# Altium schematic sheet I2C_MUX.SchDoc: RFSoC AMC
size 420 x 297 mm; CmpIndex: 31; CompanyName: WUT; DrawnBy: T. Przywozki; Organization: WUT ISE; Address1: Warsaw University of Technology; Address2: Nowowiejska 15/19 00-665 Warsaw; Address3: Tomasz.Przywozki@pw.edu.pl; DocumentNumber: 30; Revision: 1; SheetNumber: 30; SheetTotal: 45; Project: RFSoC AMC; ModifiedBy: T. Przywozki; CreateDate: -; CheckedDate: -; DivGrp: ISE; Designer: T. Przywozki; ModifiedDate: -; ProjectName: ADC/DAC MEZZANINE
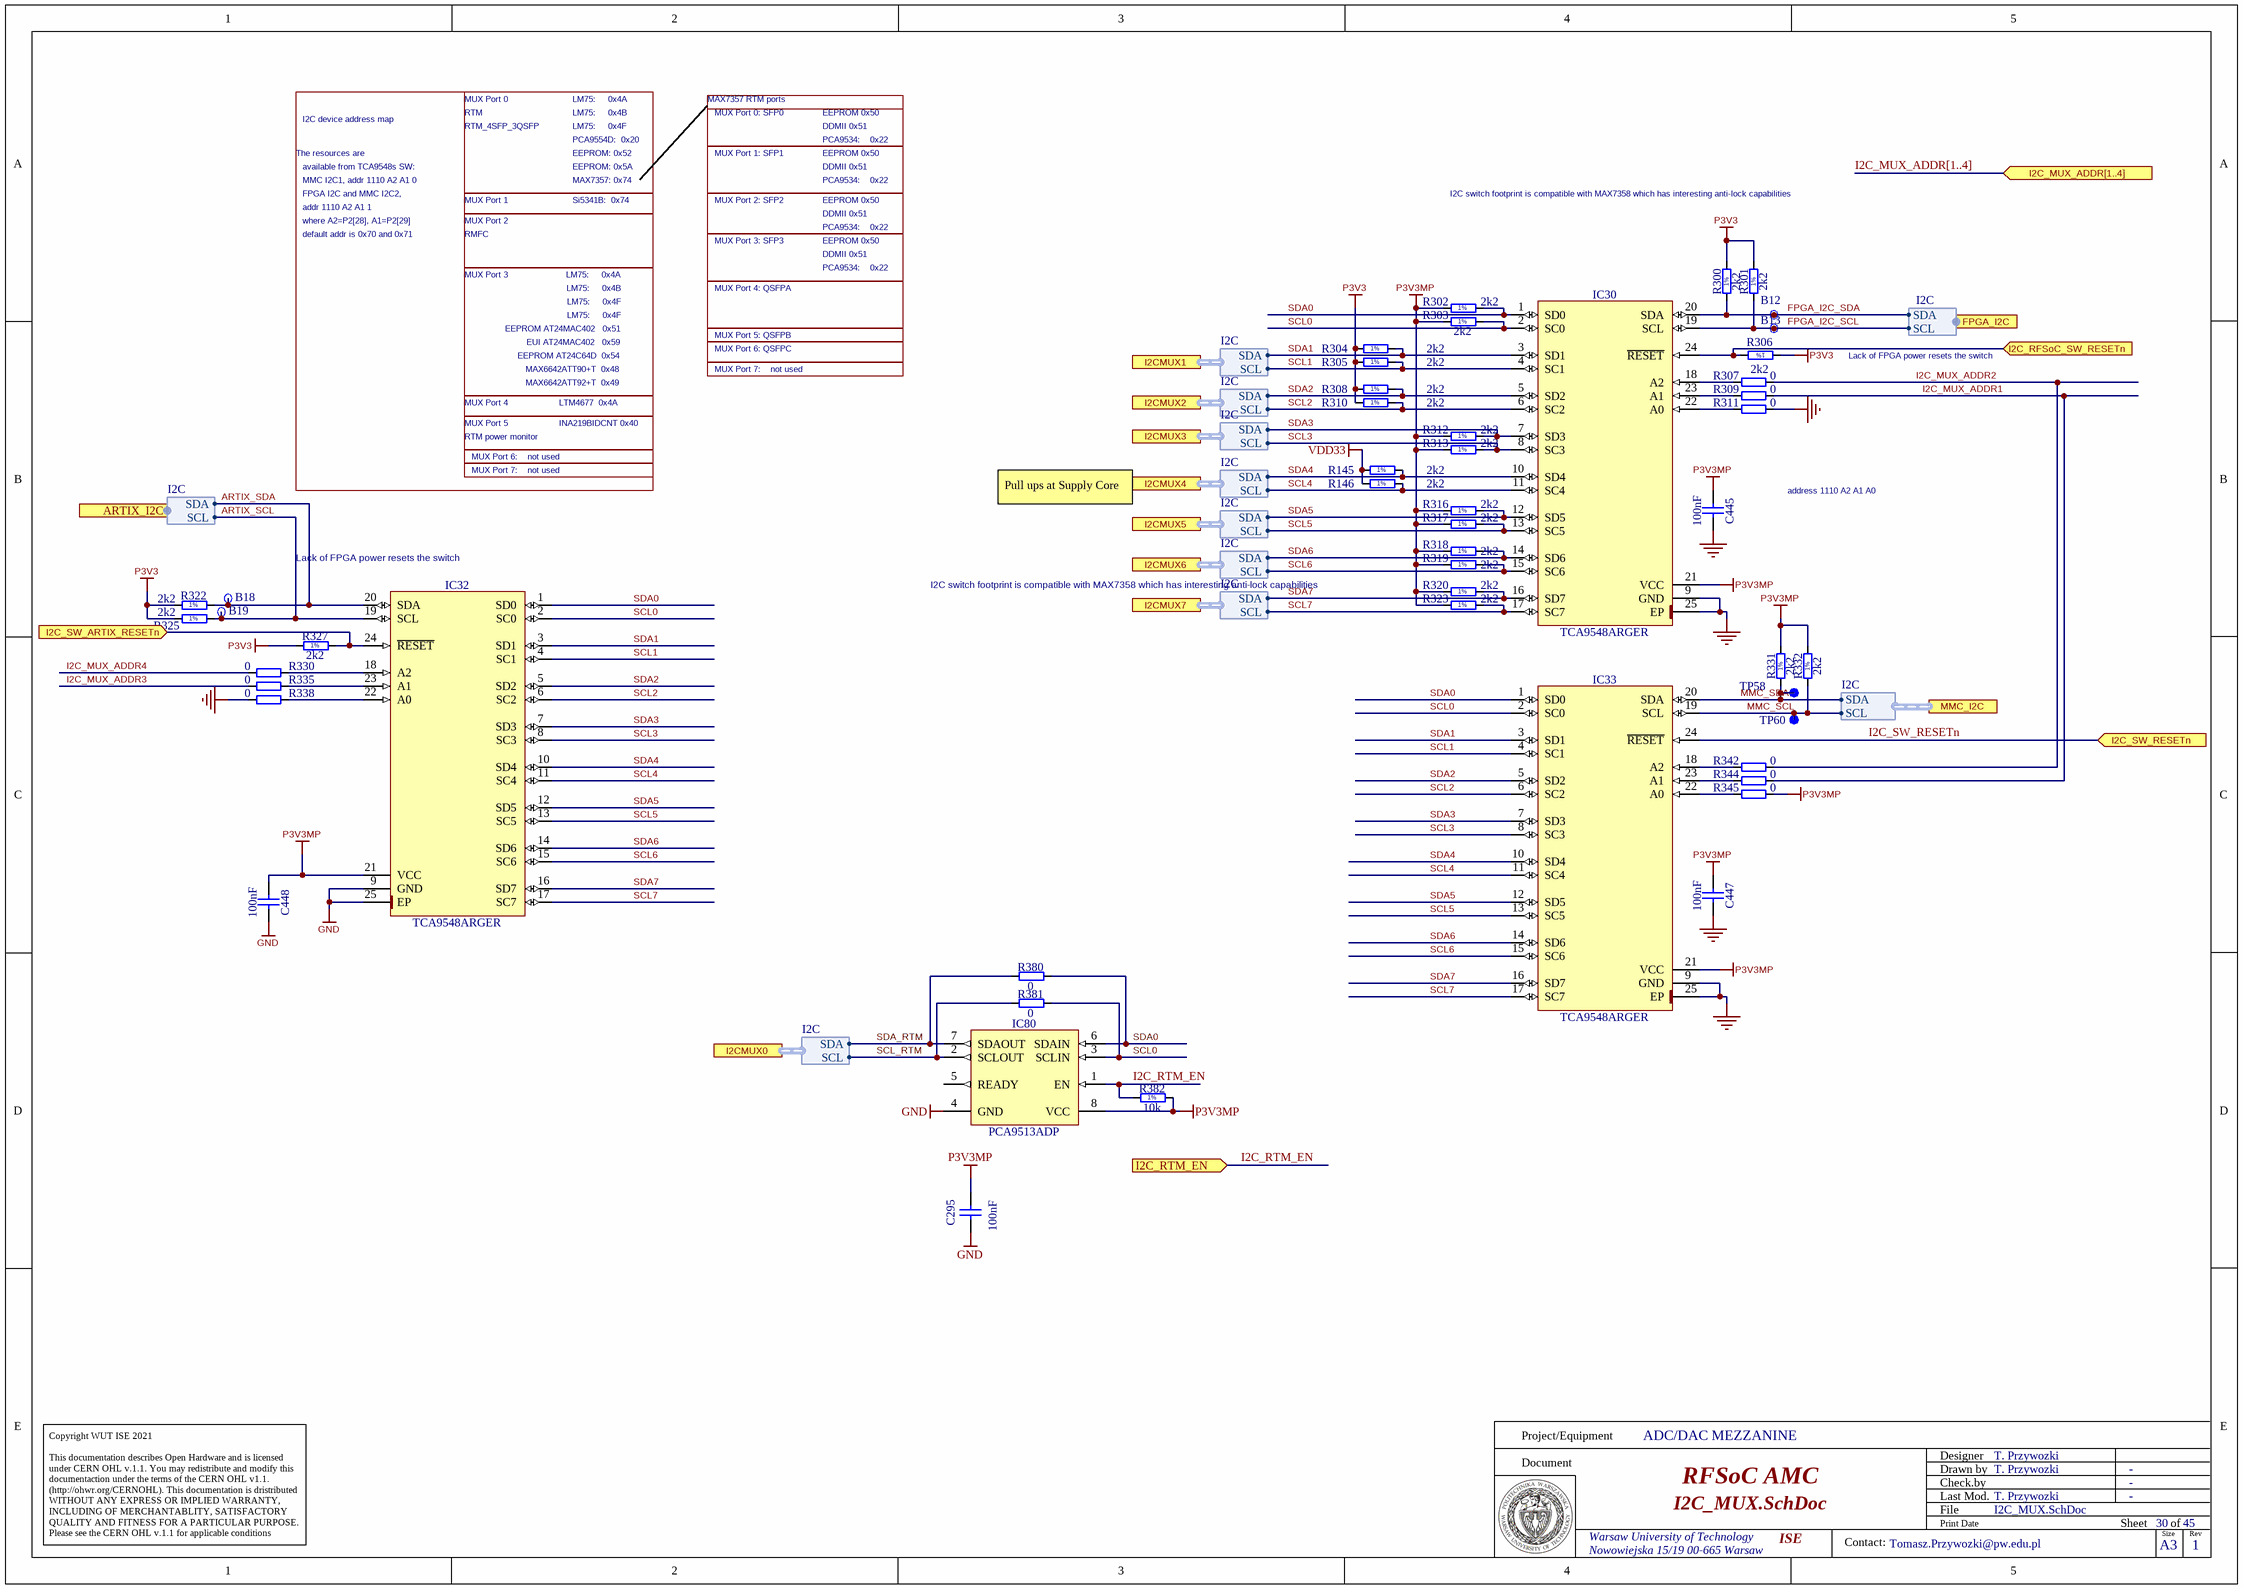
[diagram p0: I2C_MUX.SchDoc]

## Parts
B12  SMD_PAD_D1MM  [C100]  (value not drawn)
B13  SMD_PAD_D1MM  [C100]  (value not drawn)
B18  SMD_PAD_D1MM  [C100]  (value not drawn)
B19  SMD_PAD_D1MM  [C100]  (value not drawn)
C295  100nF  [CAPC0603X33N]
C445  100nF  [CAPC0603X33N]
C447  100nF  [CAPC0603X33N]
C448  100nF  [CAPC0603X33N]
IC30  TCA9548ARGER  [QFN50P400X400X100-25N-S220]
IC32  TCA9548ARGER  [QFN50P400X400X100-25N-S220]
IC33  TCA9548ARGER  [QFN50P400X400X100-25N-S220]
IC80  PCA9513ADP  [SOP65P490X110-8N]
R145  2k2  [RESC1005X40N]
R146  2k2  [RESC1005X40N]
R300  2k2  [RESC1005X40N]
R301  2k2  [RESC1005X40N]
R302  2k2  [RESC1005X40N]
R303  2k2  [RESC1005X40N]
R304  2k2  [RESC1005X40N]
R305  2k2  [RESC1005X40N]
R306  2k2  [RESC1005X40N]
R307  0  [RESC1005X40N]
R308  2k2  [RESC1005X40N]
R309  0  [RESC1005X40N]
R310  2k2  [RESC1005X40N]
R311  0  [RESC1005X40N]
R312  2k2  [RESC1005X40N]
R313  2k2  [RESC1005X40N]
R316  2k2  [RESC1005X40N]
R317  2k2  [RESC1005X40N]
R318  2k2  [RESC1005X40N]
R319  2k2  [RESC1005X40N]
R320  2k2  [RESC1005X40N]
R322  2k2  [RESC1005X40N]
R323  2k2  [RESC1005X40N]
R325  2k2  [RESC1005X40N]
R327  2k2  [RESC1005X40N]
R330  0  [RESC1005X40N]
R331  2k2  [RESC1005X40N]
R332  2k2  [RESC1005X40N]
R335  0  [RESC1005X40N]
R338  0  [RESC1005X40N]
R342  0  [RESC1005X40N]
R344  0  [RESC1005X40N]
R345  0  [RESC1005X40N]
R380  0  [RESC1005X40N]
R381  0  [RESC1005X40N]
R382  10k  [RESC1005X40N]
TP58  SMD Pad  [C100]  (value not drawn)
TP60  SMD Pad  [C100]  (value not drawn)

## Ports
ARTIX_I2C (harness I2C), FPGA_I2C (harness I2C), I2C_MUX_ADDR[1..4] (in), I2C_RFSoC_SW_RESETn (in), I2C_RTM_EN (in), I2C_SW_ARTIX_RESETn (in), I2C_SW_RESETn (in), I2CMUX0 (harness I2C), I2CMUX1 (harness I2C), I2CMUX2 (harness I2C), I2CMUX3 (harness I2C), I2CMUX4 (harness I2C), I2CMUX5 (harness I2C), I2CMUX6 (harness I2C), I2CMUX7 (harness I2C), MMC_I2C (harness I2C)

## Harnesses
I2C: SCL, SDA
I2C: SDA, SCL

## Nets
GND: C295.2 C445.2 C447.2 C448.1 IC30.9(GND) IC30.25(EP) IC32.9(GND) IC32.25(EP) IC33.9(GND) IC33.25(EP) IC80.4(GND) R311.1 R338.2
P3V3: R300.2 R301.2 R304.1 R305.1 R306.1 R308.1 R310.1 R322.2 R325.2 R327.2
P3V3MP: C295.1 C445.1 C447.1 C448.2 IC30.21(VCC) IC32.21(VCC) IC33.21(VCC) IC80.8(VCC) R302.1 R303.1 R312.1 R313.1 R316.1 R317.1 R318.1 R319.1 R320.1 R323.1 R331.2 R332.2 R345.1 R382.2
VDD33: R145.1 R146.1
ARTIX_SCL: B19.1 IC32.19(SCL) R325.1 ; port ARTIX_I2C.SCL
ARTIX_SDA: B18.1 IC32.20(SDA) R322.1 ; port ARTIX_I2C.SDA
FPGA_I2C_SCL: B13.1 IC30.19(SCL) R301.1 ; port FPGA_I2C.SCL
FPGA_I2C_SDA: B12.1 IC30.20(SDA) R300.1 ; port FPGA_I2C.SDA
I2C_MUX_ADDR1: R309.1 R344.1
I2C_MUX_ADDR2: R307.1 R342.1
I2C_MUX_ADDR3: R335.2
I2C_MUX_ADDR4: R330.2
I2C_RFSoC_SW_RESETn: IC30.24(~{RESET}) R306.2 ; port I2C_RFSoC_SW_RESETn
I2C_RTM_EN: IC80.1(EN) R382.1 ; port I2C_RTM_EN
I2C_SW_ARTIX_RESETn: IC32.24(~{RESET}) R327.1 ; port I2C_SW_ARTIX_RESETn
I2C_SW_RESETn: IC33.24(~{RESET}) ; port I2C_SW_RESETn
MMC_SCL: IC33.19(SCL) R332.1 TP60.1 ; port MMC_I2C.SCL
MMC_SDA: IC33.20(SDA) R331.1 TP58.1 ; port MMC_I2C.SDA
SCL0: IC30.2(SC0) IC32.2(SC0) IC33.2(SC0) IC80.3(SCLIN) R303.2 R381.2
SCL1: IC30.4(SC1) IC32.4(SC1) IC33.4(SC1) R305.2 ; port I2CMUX1.SCL
SCL2: IC30.6(SC2) IC32.6(SC2) IC33.6(SC2) R310.2 ; port I2CMUX2.SCL
SCL3: IC30.8(SC3) IC32.8(SC3) IC33.8(SC3) R313.2 ; port I2CMUX3.SCL
SCL4: IC30.11(SC4) IC32.11(SC4) IC33.11(SC4) R146.2 ; port I2CMUX4.SCL
SCL5: IC30.13(SC5) IC32.13(SC5) IC33.13(SC5) R317.2 ; port I2CMUX5.SCL
SCL6: IC30.15(SC6) IC32.15(SC6) IC33.15(SC6) R319.2 ; port I2CMUX6.SCL
SCL7: IC30.17(SC7) IC32.17(SC7) IC33.17(SC7) R323.2 ; port I2CMUX7.SCL
SCL_RTM: IC80.2(SCLOUT) R381.1 ; port I2CMUX0.SCL
SDA0: IC30.1(SD0) IC32.1(SD0) IC33.1(SD0) IC80.6(SDAIN) R302.2 R380.2
SDA1: IC30.3(SD1) IC32.3(SD1) IC33.3(SD1) R304.2 ; port I2CMUX1.SDA
SDA2: IC30.5(SD2) IC32.5(SD2) IC33.5(SD2) R308.2 ; port I2CMUX2.SDA
SDA3: IC30.7(SD3) IC32.7(SD3) IC33.7(SD3) R312.2 ; port I2CMUX3.SDA
SDA4: IC30.10(SD4) IC32.10(SD4) IC33.10(SD4) R145.2 ; port I2CMUX4.SDA
SDA5: IC30.12(SD5) IC32.12(SD5) IC33.12(SD5) R316.2 ; port I2CMUX5.SDA
SDA6: IC30.14(SD6) IC32.14(SD6) IC33.14(SD6) R318.2 ; port I2CMUX6.SDA
SDA7: IC30.16(SD7) IC32.16(SD7) IC33.16(SD7) R320.2 ; port I2CMUX7.SDA
SDA_RTM: IC80.7(SDAOUT) R380.1 ; port I2CMUX0.SDA
NetIC30_18: IC30.18(A2) R307.2
NetIC30_22: IC30.22(A0) R311.2
NetIC30_23: IC30.23(A1) R309.2
NetIC32_18: IC32.18(A2) R330.1
NetIC32_22: IC32.22(A0) R338.1
NetIC32_23: IC32.23(A1) R335.1
NetIC33_18: IC33.18(A2) R342.2
NetIC33_22: IC33.22(A0) R345.2
NetIC33_23: IC33.23(A1) R344.2

Not connected (* = marked no-connect by the designer): IC80 5(READY)

## Buses and harness runs
bus I2C_MUX_ADDR[1..4] = port I2C_MUX_ADDR[1..4]

## Notes on the sheet
- I2C device address map
- MUX Port 0
- RTM
- RTM_4SFP_3QSFP
- LM75:     0x4A
- LM75:     0x4B
- LM75:     0x4F
- MAX7357 RTM ports
- MUX Port 0: SFP0
- DDMII 0x51
- EEPROM 0x50
- The resources are
- available from TCA9548s SW:
- MMC I2C1, addr 1110 A2 A1 0
- EEPROM: 0x52
- PCA9554D:  0x20
- EEPROM: 0x5A
- MAX7357: 0x74
- MUX Port 1: SFP1
- PCA9534:    0x22
- FPGA I2C and MMC I2C2,
- addr 1110 A2 A1 1
- where A2=P2[28], A1=P2[29]
- default addr is 0x70 and 0x71
- MUX Port 2
- MUX Port 1
- RMFC
- Si5341B:  0x74
- MUX Port 2: SFP2
- MUX Port 3: SFP3
- I2C switch footprint is compatible with MAX7358 which has interesting anti-lock capabilities
- MUX Port 3
- MUX Port 4: QSFPA
- EEPROM AT24MAC402   0x51
- EEPROM AT24C64D  0x54
- MAX6642ATT90+T  0x48
- MAX6642ATT92+T  0x49
- EUI AT24MAC402   0x59
- MUX Port 5: QSFPB
- MUX Port 6: QSFPC
- MUX Port 7:    not used
- Lack of FPGA power resets the switch
- MUX Port 4
- MUX Port 5
- RTM power monitor
- MUX Port 6:    not used
- LTM4677  0x4A
- INA219BIDCNT 0x40
- Pull ups at Supply Core
- address 1110 A2 A1 A0
- (near IC32) I2C switch footprint is compatible with MAX7358 which has interesting anti-lock capabilities
- Project/Equipment
- Document
- Designer
- Drawn by
- Check.by
- Copyright WUT ISE 2021
  This documentation describes Open Hardware and is licensed under CERN OHL v.1.1. You may redistribute and modify this documentaction under the terms of the CERN OHL v1.1.
  (http://ohwr.org/CERNOHL). This documentation is dristributed WITHOUT ANY EXPRESS OR IMPLIED WARRANTY, INCLUDING OF MERCHANTABLITY, SATISFACTORY QUALITY AND FITNESS FOR A PARTICULAR PURPOSE. Please see the CERN OHL v.1.1 for applicable conditions
- File
- Last Mod.
- Print Date
- Sheet
- Size
- A3
- of
- Rev
- Contact:
- (in symbol R0402_2K2_1%_0.0625W_100PPM) 1%
- (in symbol R0402_10K_1%_0.0625W_100PPM) 1%

## Library data of the parts
B12 B13 B18 B19 = C100: $$NotCommonProperty_Partition: Pads; Part Description: 1mm Diameter SMD Pad; $$Internal_Resolution: 00001mm; $$NotCommonProperty_Family: SMD Pad; $$NotCommonProperty_Mounted: No; $$NotCommonProperty_Pin Count: 1; $$NotCommonProperty_Sense: No; $$NotCommonProperty_Status: None; CmpIndex: 236; Ref Designator: B5; SymIndex: 2108; $$NotCommonProperty_ComponentHeight: 0mm; $$NotCommonProperty_Footprint Ref: C100; $$NotCommonProperty_SMD: No; $$NotCommonProperty_Socket: No; Cell Name: C100; PackageDescription: 1mm Diameter SMD Pad; Part Name: SMD_PAD_D1MM; Part Number: SMD_PAD_D1MM; Orientation: 0 = 0
C295 C445 C447 = CC0201_100NF_6.3V_10%_X5R: Non-polarised capacitor; Manufacturer: GENERIC; Part Description: SMD Multilayer Chip Ceramic Capacitor; Manufacturer1 Part Number: 02016D104KAT2A; Tolerance: ±10%; Voltage: 6.3V; TC: X5R; Manufacturer Part Number: CC0201_100NF_6.3V_10%_X5R; Part Number: CC0201_100NF_6.3V_10%_X5R; Value: 100nF; Component Kind: Standard; Component Type: Standard; Pin Count: 2; Status: Not Recommended; Case: 0201; Mounted: Yes; Socket: No; SMD: Yes; Sense: No; Manufacturer1 Example: AVX; Manufacturer1 ComponentHeight: 0.33mm; HelpURL: \\cern.ch\dfs\Applications\Altium\Datasheets\CC0201_X5R_AVX.pdf; Author: CERN DEM JLC; CreateDate: 03/12/2007; LatestRevisionDate: 03/12/2007
C448 = CC0201_100NF_6.3V_10%_X5R: Non-polarised capacitor; Manufacturer: GENERIC; Manufacturer1 Part Number: 02016D104KAT2A; Part Description: SMD Multilayer Chip Ceramic Capacitor; TC: X5R; Tolerance: ±10%; Voltage: 6.3V; Case: 0201; Manufacturer Part Number: CC0201_100NF_6.3V_10%_X5R; Manufacturer1 Example: AVX; Part Number: CC0201_100NF_6.3V_10%_X5R; Pin Count: 2; SMD: Yes; Status: Not Recommended; Value: 100nF; Component Kind: Standard; Component Type: Standard; Mounted: Yes; Socket: No; Sense: No; Manufacturer1 ComponentHeight: 0.33mm; HelpURL: \\cern.ch\dfs\Applications\Altium\Datasheets\CC0201_X5R_AVX.pdf; Author: CERN DEM JLC; CreateDate: 03.12.2007; LatestRevisionDate: 03.12.2007
IC30 IC33 = TCA9548ARGER: Low Voltage 8-Channel I2C Switch With Reset; Manufacturer: TEXAS INSTRUMENTS; PressFit: No; Bonding: No; Manufacturer Part Number: TCA9548ARGER; PackageDescription: QFN, 0.50mm Pitch, Square; 24 Pin, 4.00mm L X 4.00mm W X 1.00mm H body (w/thermal tab 2.2 X 2.2mm), IPC Medium Density; Part Description: Low Voltage 8-Channel I2C Switch With Reset; Part Number: TCA9548ARGER; Component Kind: Standard; Component Type: Standard; Device: TCA9548ARGER; Pin Count: 25; Case: QFN24; Mounted: Yes; Socket: No; SMD: Yes; Sense: No; ComponentHeight: 1mm; Author: CERN DEM JLC; HelpURL: \\cern.ch\dfs\Applications\Altium\Datasheets\TCA9548ARGER.pdf; CreateDate: 07/07/2014; LatestRevisionDate: 07/07/2014
IC32 = TCA9548ARGER: Low Voltage 8-Channel I2C Switch With Reset; Manufacturer: TEXAS INSTRUMENTS; Bonding: No; PressFit: No; Case: QFN24; ComponentHeight: 1mm; Device: TCA9548ARGER; Manufacturer Part Number: TCA9548ARGER; Mounted: Yes; PackageDescription: QFN, 0.50mm Pitch, Square; 24 Pin, 4.00mm L X 4.00mm W X 1.00mm H body (w/thermal tab 2.2 X 2.2mm), IPC Medium Density; Part Description: Low Voltage 8-Channel I2C Switch With Reset; Part Number: TCA9548ARGER; Pin Count: 25; Sense: No; SMD: Yes; Socket: No; Component Kind: Standard; Component Type: Standard; Author: CERN DEM JLC; HelpURL: \\cern.ch\dfs\Applications\Altium\Datasheets\TCA9548ARGER.pdf; CreateDate: 07.07.2014; LatestRevisionDate: 07.07.2014
IC80 = PCA9513ADP: Hot Swappable I2C-Bus and SMBus Bus Buffer; Manufacturer: NXP SEMICONDUCTORS; PressFit: No; Bonding: No; Part Number: PCA9513ADP; Component Kind: Standard; Component Type: Standard; Device: PCA9513ADP; PackageDescription: SOP, 0.65mm Pitch; 8 Pin, 3.00mm W X 3.00mm L X 1.10mm H body, IPC Medium Density; Part Description: Hot Swappable I2C-Bus and SMBus Bus Buffer; Manufacturer Part Number: PCA9513ADP; Pin Count: 8; Case: TSSOP8; Mounted: Yes; Socket: No; SMD: Yes; Sense: No; ComponentHeight: 1.1mm; Author: CERN DEM MR; HelpURL: \\cern.ch\dfs\Applications\Altium\Datasheets\PCA9513ADP.pdf; CreateDate: 21.11.2019; LatestRevisionDate: 21.11.2019
R145 R146 R300-R306 R308 R310 R312 R313 R316-R320 R323 R331 R332 = R0402_2K2_1%_0.0625W_100PPM: Resistor - 1%; Manufacturer: GENERIC; Part Description: General Purpose Thick Film Chip Resistor; Manufacturer1 Part Number: 232270672202L; TC: ±100ppm/°C; PressFit: No; Manufacturer Part Number: R0402_2K2_1%_0.0625W_100PPM; Part Number: R0402_2K2_1%_0.0625W_100PPM; Tolerance: ±1%; Value: 2k2; Component Kind: Standard; Component Type: Standard; Pin Count: 2; Status: Not Recommended; Power: 0.0625W; Case: 0402; Mounted: Yes; Sense: No; Socket: No; SMD: Yes; Manufacturer1 Example: YAGEO PHYCOMP; Manufacturer1 ComponentHeight: 0.4mm; HelpURL: \\cern.ch\dfs\Applications\Altium\Datasheets\R0402_Phycomp_RC0402.pdf; Author: CERN DEM JLC; CreateDate: 03/12/2007; LatestRevisionDate: 17/10/2012
R307 R309 R311 R342 R344 R345 = R0402_0R_JUMPER: Resistor; Manufacturer: GENERIC; Part Description: 1A (0.05R Max DC Resistance) Zero Ohm Jumper; Manufacturer1 Part Number: 232270591001L; PressFit: No; Manufacturer Part Number: R0402_0R_JUMPER; Part Number: R0402_0R_JUMPER; Value: 0; Component Kind: Standard; Component Type: Standard; Pin Count: 2; Status: Not Recommended; Case: 0402; Mounted: Yes; Sense: No; Socket: No; SMD: Yes; Manufacturer1 Example: YAGEO PHYCOMP; Manufacturer1 ComponentHeight: 0.4mm; HelpURL: \\cern.ch\dfs\Applications\Altium\Datasheets\R0402_Phycomp_RC0402.pdf; Author: CERN DEM JLC; CreateDate: 03/12/2007; LatestRevisionDate: 17/10/2012
R322 R325 R327 = R0402_2K2_1%_0.0625W_100PPM: Resistor - 1%; Manufacturer: GENERIC; Manufacturer1 Part Number: 232270672202L; Part Description: General Purpose Thick Film Chip Resistor; TC: ±100ppm/°C; PressFit: No; Case: 0402; Manufacturer Part Number: R0402_2K2_1%_0.0625W_100PPM; Manufacturer1 ComponentHeight: 0.4mm; Manufacturer1 Example: YAGEO PHYCOMP; Part Number: R0402_2K2_1%_0.0625W_100PPM; Pin Count: 2; Power: 0.0625W; Sense: No; SMD: Yes; Status: Not Recommended; Tolerance: ±1%; Value: 2k2; Component Kind: Standard; Component Type: Standard; Mounted: Yes; Socket: No; HelpURL: \\cern.ch\dfs\Applications\Altium\Datasheets\R0402_Phycomp_RC0402.pdf; Author: CERN DEM JLC; CreateDate: 03.12.2007; LatestRevisionDate: 17.10.2012
R330 R335 R338 = R0402_0R_JUMPER: Resistor; Manufacturer: GENERIC; Manufacturer1 Part Number: 232270591001L; Part Description: 1A (0.05R Max DC Resistance) Zero Ohm Jumper; PressFit: No; Case: 0402; Manufacturer Part Number: R0402_0R_JUMPER; Manufacturer1 ComponentHeight: 0.4mm; Manufacturer1 Example: YAGEO PHYCOMP; Part Number: R0402_0R_JUMPER; Pin Count: 2; Sense: No; SMD: Yes; Status: Not Recommended; Value: 0; Component Kind: Standard; Component Type: Standard; Mounted: Yes; Socket: No; HelpURL: \\cern.ch\dfs\Applications\Altium\Datasheets\R0402_Phycomp_RC0402.pdf; Author: CERN DEM JLC; CreateDate: 03.12.2007; LatestRevisionDate: 17.10.2012
R380 R381 = R0402_0R_JUMPER: Resistor; Part Description: 1A (0.05R Max DC Resistance) Zero Ohm Jumper; Manufacturer: GENERIC; Manufacturer1 Part Number: 232270591001L; PressFit: No; Part Number: R0402_0R_JUMPER; Component Kind: Standard; Component Type: Standard; Pin Count: 2; Value: 0; Status: Not Recommended; Manufacturer Part Number: R0402_0R_JUMPER; Case: 0402; Mounted: Yes; Sense: No; Socket: No; SMD: Yes; Manufacturer1 Example: YAGEO PHYCOMP; Manufacturer1 ComponentHeight: 0.4mm; HelpURL: \\cern.ch\dfs\Applications\Altium\Datasheets\R0402_Phycomp_RC0402.pdf; Author: CERN DEM JLC; CreateDate: 03.12.2007; LatestRevisionDate: 17.10.2012
R382 = R0402_10K_1%_0.0625W_100PPM: Resistor - 1%; Part Description: General Purpose Thick Film Chip Resistor; Manufacturer: GENERIC; Manufacturer1 Part Number: 232270671003L; TC: ±100ppm/°C; PressFit: No; Part Number: R0402_10K_1%_0.0625W_100PPM; Component Kind: Standard; Component Type: Standard; Pin Count: 2; Value: 10k; Status: Not Recommended; Power: 0.0625W; Tolerance: ±1%; Manufacturer Part Number: R0402_10K_1%_0.0625W_100PPM; Case: 0402; Mounted: Yes; Sense: No; Socket: No; SMD: Yes; Manufacturer1 Example: YAGEO PHYCOMP; Manufacturer1 ComponentHeight: 0.4mm; HelpURL: \\cern.ch\dfs\Applications\Altium\Datasheets\R0402_Phycomp_RC0402.pdf; Author: CERN DEM JLC; CreateDate: 03.12.2007; LatestRevisionDate: 17.10.2012
TP58 TP60 = SMD_PAD_D1MM: Through Hole Pad; Part Description: 1mm Diameter SMD Pad; Mounted: No; PackageDescription: 1mm Diameter SMD Pad; Part Number: SMD_PAD_D1MM; Component Kind: Standard (No BOM); Component Type: Standard (No BOM); Pin Count: 1; Family: SMD Pad; Socket: No; SMD: No; Sense: No; Status: None; ComponentHeight: 0mm; HelpURL: Undefined; Author: CERN DEM JLC; CreateDate: 10.10.2017; LatestRevisionDate: 10.10.2017